# Altium schematic sheet ESP32.SchDoc
size A; SheetNumber: 1; SheetTotal: 14
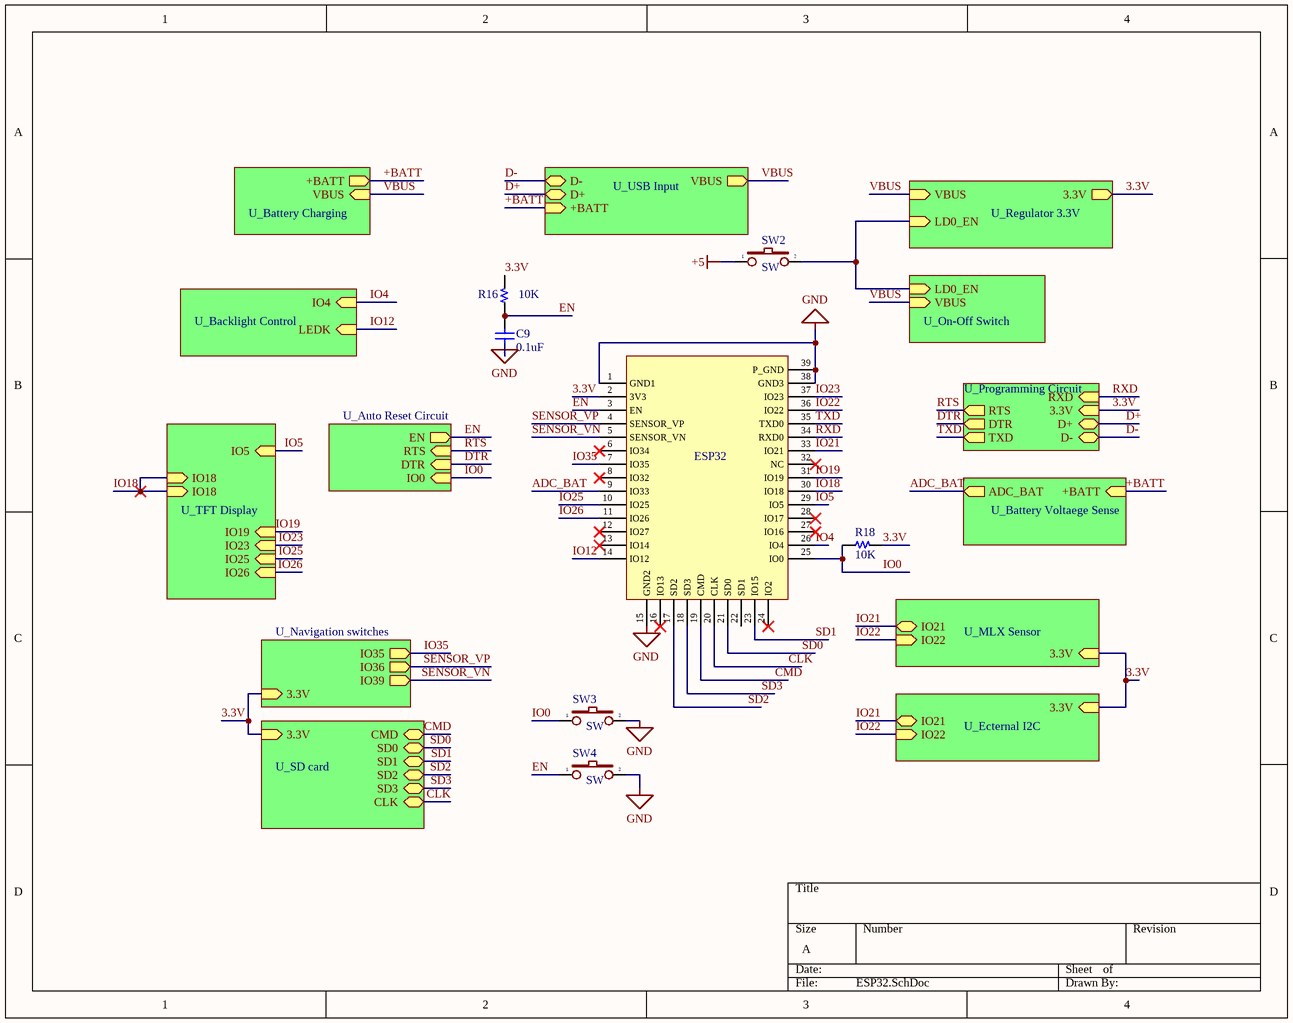
[diagram p0: ESP32.SchDoc]

## Parts
C9  0.1uF  [C 0805]
ESP32  ESP32  [ESP_WROOM_32]  (value not drawn)
R16  10K  [R 0805]
R18  10K  [R 0805]
SW2  SW  [SW2]
SW3  SW  [SW2]
SW4  SW  [SW2]

## Sub-sheets
U_Auto Reset Circuit = Auto Reset Circuit.SchDoc: IO0 (in), DTR (in), RTS (in), EN (out)
U_Backlight Control = Backlight Control.SchDoc: LEDK (in), IO4 (in)
U_Battery Charging = Battery Charging.SchDoc: VBUS (in), +BATT (out)
U_Battery Voltaege Sense = Battery Voltaege Sense.SchDoc: +BATT (in), ADC_BAT (out)
U_Ecternal I2C = Ecternal I2C.SchDoc: 3.3V (in), IO21 (bidir), IO22 (in)
U_MLX Sensor = MLX Sensor.SchDoc: 3.3V (in), IO21 (bidir), IO22 (in)
U_Navigation switches = Navigation switches.SchDoc: 3.3V (in), IO35 (out), IO36 (out), IO39 (out)
U_On-Off Switch = On-Off Switch.SchDoc: LD0_EN (in), VBUS (in)
U_Programming Circuit = Programming Circuit.SchDoc: D- (bidir), D+ (bidir), 3.3V (in), RXD (in), TXD (out), DTR (out), RTS (out)
U_Regulator 3.3V = Regulator 3.3V.SchDoc: VBUS (in), 3.3V (out), LD0_EN (in)
U_SD card = SD card.SchDoc: 3.3V (in), CMD (bidir), SD0 (bidir), SD3 (bidir), CLK (bidir), SD1 (bidir), SD2 (bidir)
U_TFT Display = TFT Display.SchDoc: IO26 (in), IO25 (in), IO5 (in), IO23 (in), IO19 (in), IO18 (in), IO18 (in)
U_USB Input = USB Input.SchDoc: VBUS (out), D- (bidir), D+ (bidir), +BATT (in)

## Nets
+5: SW2.1
GND: C9.2 ESP32.1(GND1) ESP32.15(GND2) ESP32.38(GND3) ESP32.39(P_GND) SW3.2 SW4.2
3.3V: ESP32.2(3V3) R16.2 R18.2 ; sheet U_Programming Circuit/3.3V, sheet U_Regulator 3.3V/3.3V, sheet U_MLX Sensor/3.3V, sheet U_Ecternal I2C/3.3V, sheet U_Navigation switches/3.3V, sheet U_SD card/3.3V
+BATT: sheet U_USB Input/+BATT, sheet U_Battery Voltaege Sense/+BATT, sheet U_Battery Charging/+BATT
ADC_BAT: ESP32.9(IO33) ; sheet U_Battery Voltaege Sense/ADC_BAT
CLK: ESP32.20(CLK) ; sheet U_SD card/CLK
CMD: ESP32.19(CMD) ; sheet U_SD card/CMD
D+: sheet U_Programming Circuit/D+, sheet U_USB Input/D+
D-: sheet U_Programming Circuit/D-, sheet U_USB Input/D-
DTR: sheet U_Programming Circuit/DTR, sheet U_Auto Reset Circuit/DTR
EN: C9.1 ESP32.3(EN) R16.1 SW4.1 ; sheet U_Auto Reset Circuit/EN
IO0: ESP32.25(IO0) R18.1 SW3.1 ; sheet U_Auto Reset Circuit/IO0
IO4: ESP32.26(IO4) ; sheet U_Backlight Control/IO4
IO5: ESP32.29(IO5) ; sheet U_TFT Display/IO5
IO12: ESP32.14(IO12) ; sheet U_Backlight Control/LEDK
IO18: ESP32.30(IO18) ; sheet U_TFT Display/IO18, sheet U_TFT Display/IO18
IO19: ESP32.31(IO19) ; sheet U_TFT Display/IO19
IO21: ESP32.33(IO21) ; sheet U_MLX Sensor/IO21, sheet U_Ecternal I2C/IO21
IO22: ESP32.36(IO22) ; sheet U_MLX Sensor/IO22, sheet U_Ecternal I2C/IO22
IO23: ESP32.37(IO23) ; sheet U_TFT Display/IO23
IO25: ESP32.10(IO25) ; sheet U_TFT Display/IO25
IO26: ESP32.11(IO26) ; sheet U_TFT Display/IO26
IO35: ESP32.7(IO35) ; sheet U_Navigation switches/IO35
RTS: sheet U_Programming Circuit/RTS, sheet U_Auto Reset Circuit/RTS
RXD: ESP32.34(RXD0) ; sheet U_Programming Circuit/RXD
SD0: ESP32.21(SD0) ; sheet U_SD card/SD0
SD1: ESP32.23(IO15) ; sheet U_SD card/SD1
SD2: ESP32.17(SD2) ; sheet U_SD card/SD2
SD3: ESP32.18(SD3) ; sheet U_SD card/SD3
SENSOR_VN: ESP32.5(SENSOR_VN) ; sheet U_Navigation switches/IO39
SENSOR_VP: ESP32.4(SENSOR_VP) ; sheet U_Navigation switches/IO36
TXD: ESP32.35(TXD0) ; sheet U_Programming Circuit/TXD
VBUS: sheet U_Regulator 3.3V/VBUS, sheet U_USB Input/VBUS, sheet U_On-Off Switch/VBUS, sheet U_Battery Charging/VBUS
NetSW2_2: SW2.2 ; sheet U_Regulator 3.3V/LD0_EN, sheet U_On-Off Switch/LD0_EN

Not connected (* = marked no-connect by the designer): ESP32 6(IO34)* 8(IO32)* 12(IO27)* 13(IO14)* 16(IO13)* 22(SD1) 24(IO2)* 27(IO16)* 28(IO17)* 32(NC)*

## Library data of the parts
C9 = Capacitor NP: Capacitor non-pol
ESP32 = ESP-WROOM-32
R16 R18 = Resistor
SW2-SW4 = SW2: Switch button 2 pin; Value: SW chip 2 pin